# Altium schematic sheet main.SchDoc: <Title>
size A4; SheetNumber: 1; SheetTotal: 1; SheetTitle: <SheetTitle>
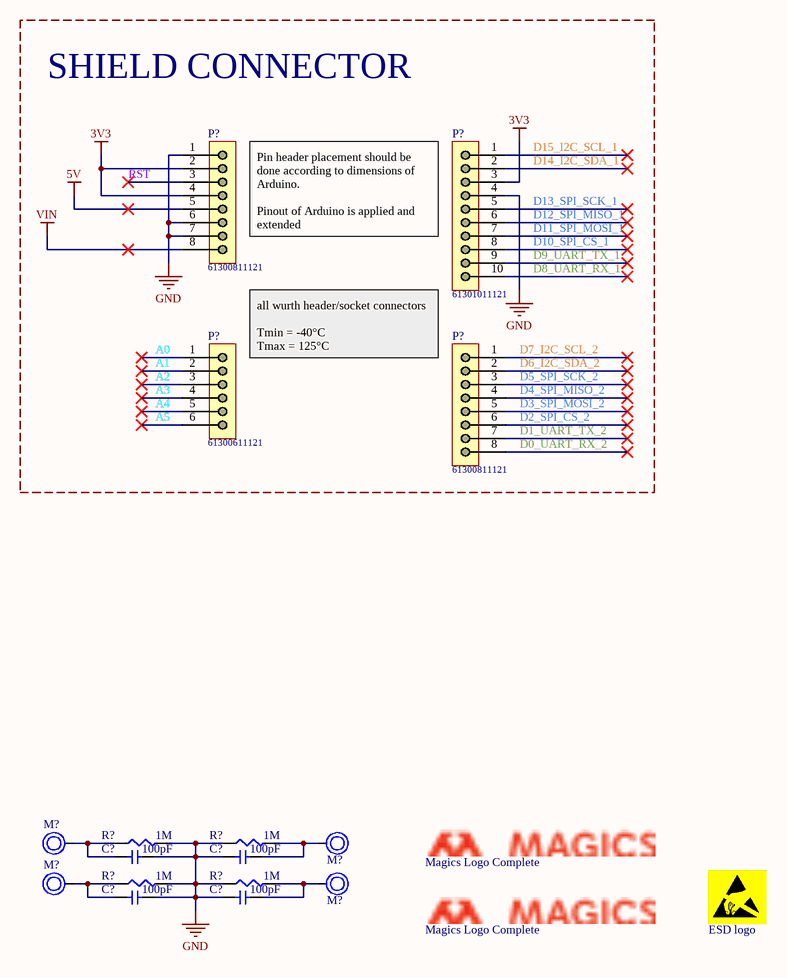
[diagram p0: main.SchDoc]

## Parts
(Parts that share a designator on the sheet are numbered #1, #2 ... from top to bottom, then left to right.)
C?#1  value 100pF  [CAPC0603X09]  (hidden comment: CAPC0603X09_100p_5%_100V_NP0)
C?#2  value 100pF  [CAPC0603X09]  (hidden comment: CAPC0603X09_100p_5%_100V_NP0)
C?#3  value 100pF  [CAPC0603X09]  (hidden comment: CAPC0603X09_100p_5%_100V_NP0)
C?#4  value 100pF  [CAPC0603X09]  (hidden comment: CAPC0603X09_100p_5%_100V_NP0)
M?#1  Mounting_Hole_arduino  [Mounting_Hole_arduino-Footprint-1]  (value not drawn)
M?#2  Mounting_Hole_arduino  [Mounting_Hole_arduino-Footprint-1]  (value not drawn)
M?#3  Magics Logo Complete  [Magics Logo]  (no BOM)
M?#4  Mounting_Hole_arduino  [Mounting_Hole_arduino-Footprint-1]  (value not drawn)
M?#5  Mounting_Hole_arduino  [Mounting_Hole_arduino-Footprint-1]  (value not drawn)
M?#6  Magics Logo Complete  [Magics Logo]  (no BOM)
M?#7  ESD logo  [ESD logo]  (no BOM)
P?#1  61300811121  [61300811121]
P?#2  61301011121  [61301011121]
P?#3  61300611121  [61300611121]
P?#4  61300811121  [61300811121]
R?#1  value 1M  [RESC0603X06]  (hidden comment: RESC0603X06_1M_5%_100mW)
R?#2  value 1M  [RESC0603X06]  (hidden comment: RESC0603X06_1M_5%_100mW)
R?#3  value 1M  [RESC0603X06]  (hidden comment: RESC0603X06_1M_5%_100mW)
R?#4  value 1M  [RESC0603X06]  (hidden comment: RESC0603X06_1M_5%_100mW)

## Blocks framed on the sheet
SHIELD CONNECTOR: P?#1-P?#4

## Nets
3V3: P?#1.2 P?#1.4 P?#2.3
5V: P?#1.5
GND: C?#1.2 C?#2.1 C?#3.2 C?#4.1 P?#1.1 P?#1.6 P?#1.7 P?#2.4 R?#1.2 R?#2.1 R?#3.2 R?#4.1
VIN: P?#1.8
A0: P?#3.1
A1: P?#3.2
A2: P?#3.3
A3: P?#3.4
A4: P?#3.5
A5: P?#3.6
D0_UART_RX_2: P?#4.8
D1_UART_TX_2: P?#4.7
D2_SPI_CS_2: P?#4.6
D3_SPI_MOSI_2: P?#4.5
D4_SPI_MISO_2: P?#4.4
D5_SPI_SCK_2: P?#4.3
D6_I2C_SDA_2: P?#4.2
D7_I2C_SCL_2: P?#4.1
D8_UART_RX_1: P?#2.10
D9_UART_TX_1: P?#2.9
D10_SPI_CS_1: P?#2.8
D11_SPI_MOSI_1: P?#2.7
D12_SPI_MISO_1: P?#2.6
D13_SPI_SCK_1: P?#2.5
D14_I2C_SDA_1: P?#2.2
D15_I2C_SCL_1: P?#2.1
~{RST}: P?#1.3
NetC?#1_1: C?#1.1 M?#1.1 R?#1.1
NetC?#2_2: C?#2.2 M?#2.1 R?#2.2
NetC?#3_1: C?#3.1 M?#4.1 R?#3.1
NetC?#4_2: C?#4.2 M?#5.1 R?#4.2

## Notes on the sheet
- (near P?#1) Pin header placement should be done according to dimensions of Arduino.
  Pinout of Arduino is applied and extended
- (near P?#3) all wurth header/socket connectors
  Tmin = -40°C
  Tmax = 125°C
- Project:
- Designer:
- Variant:
- PCB:
- Template:
- Rev schem:
- Rev full:
- Generic_A4_V4
- Magics Technologies NV
- Version:
- Sheet
- of
- Date:
- Cipalstraat 3, 2440 Geel, Belgium

## Library data of the parts
C?#1-C?#4 = CMP-CAP-0002-0002-2: Voltage: 100V; Tolerance: 5%; Internal stock: False; Dielectric: NP0; Package: 0603; Height (max): 900µm
M?#1 M?#2 M?#4 M?#5 = CMP-00415-4: A mounting hole for the arduino. This hole can be connected to a net.
M?#3 M?#6 = CMP-00120-9: Magics Logo Silkscreen Complete
M?#7 = CMP-002-000272-6
P?#1 P?#4 = CMP-002-0576-5: WR-PHD Pin Header, THT, pitch 2.54mm, Single Row, Vertical, 8p; Manufacturer: Wurth Elektronik; Rated Current: 3A; Contact Resistance: 20mOhm; Working Voltage: 250VAC; Pin Number: 8; Withstanding Voltage: 500VAC; Mounting Technology: THT; Operating Temperature: -40 to +105degC; Source: WR-PHD_Pin Header_2.54mm.SchLib; Pitch: 2.54mm; Packaging: Bag; Component Type: Standard; Orientation: Vertical; Pin Count: 8; Design Item ID: 61300811121; Published Date: May 2020; Gender: Pin Header; Manufacturer Part Number: 61300811121; Row Number: Single
P?#2 = CMP-002-0591-3: WR-PHD Pin Header, THT, pitch 2.54mm, Single Row, Vertical, 10p; Manufacturer: Wurth Elektronik; Contact Resistance: 20mOhm; Withstanding Voltage: 500VAC; Pin Number: 10; Rated Current: 3A; Working Voltage: 250VAC; Row Number: Single; Source: WR-PHD_Pin Header_2.54mm.SchLib; Orientation: Vertical; Pin Count: 10; Gender: Pin Header; Mounting Technology: THT; Design Item ID: 61301011121; Packaging: Bag; Component Type: Standard; Published Date: May 2020; Operating Temperature: -40 to +105degC; Pitch: 2.54mm; Manufacturer Part Number: 61301011121
P?#3 = CMP-002-0561-3: WR-PHD Pin Header, THT, pitch 2.54mm, Single Row, Vertical, 6p; Manufacturer: Wurth Elektronik; Pin Number: 6; Withstanding Voltage: 500VAC; Rated Current: 3A; Contact Resistance: 20mOhm; Working Voltage: 250VAC; Row Number: Single; Orientation: Vertical; Source: WR-PHD_Pin Header_2.54mm.SchLib; Gender: Pin Header; Manufacturer Part Number: 61300611121; Pin Count: 6; Packaging: Bag; Pitch: 2.54mm; Operating Temperature: -40 to +105degC; Component Type: Standard; Published Date: May 2020; Mounting Technology: THT; Design Item ID: 61300611121
R?#1-R?#4 = CMP-RES-0011-0011-3: Power (max): 100mW; Internal stock: True; Tolerance: 5%; Package: 0603; Height (max): 600µm